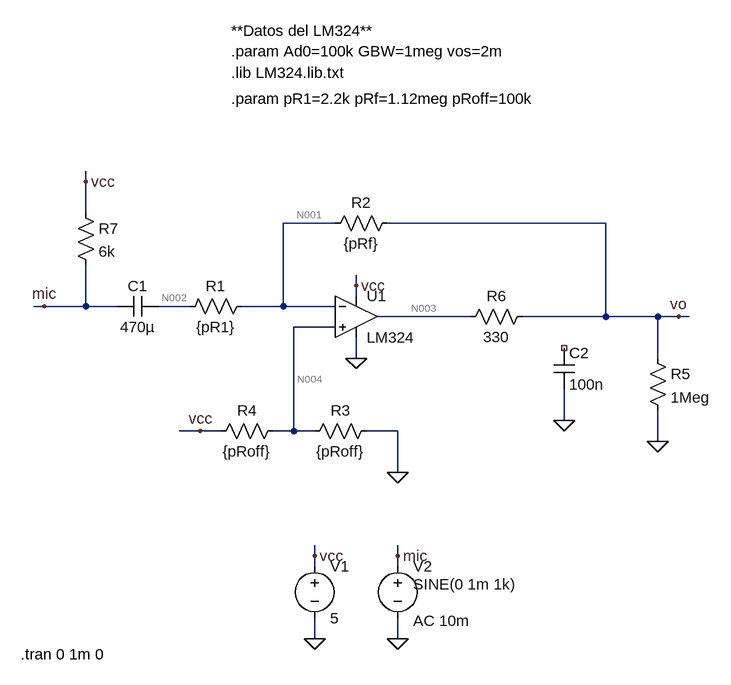
[diagram p0: schematic preamp.asc]
preamp.asc, the LTspice schematic file:
Version 4
SHEET 1 1848 744
WIRE -176 0 -176 -16
WIRE -176 48 -176 0
WIRE 208 64 128 64
WIRE 624 64 288 64
WIRE 240 160 240 144
WIRE 240 176 240 160
WIRE -240 192 -256 192
WIRE -176 192 -176 128
WIRE -176 192 -240 192
WIRE -128 192 -176 192
WIRE -16 192 -64 192
WIRE 128 192 128 64
WIRE 128 192 64 192
WIRE 208 192 128 192
WIRE 416 208 272 208
WIRE 624 208 624 64
WIRE 624 208 496 208
WIRE 704 208 624 208
WIRE 736 208 704 208
WIRE 752 208 736 208
WIRE 208 224 144 224
WIRE 240 272 240 240
WIRE 704 272 704 208
WIRE 560 368 560 320
WIRE 0 384 -32 384
WIRE 32 384 0 384
WIRE 144 384 144 224
WIRE 144 384 112 384
WIRE 176 384 144 384
WIRE 304 384 256 384
WIRE 704 400 704 352
WIRE 304 448 304 384
WIRE 176 576 176 560
WIRE 304 576 304 560
WIRE 176 592 176 576
WIRE 304 592 304 576
WIRE 176 704 176 672
WIRE 304 704 304 672
FLAG 176 704 0
FLAG 176 576 vcc
FLAG 240 160 vcc
FLAG 304 704 0
FLAG 304 576 mic
FLAG 304 448 0
FLAG 0 384 vcc
FLAG 704 400 0
FLAG -240 192 mic
FLAG 736 208 vo
FLAG 240 272 0
FLAG 560 368 0
FLAG -176 0 vcc
SYMBOL voltage 176 576 R0
WINDOW 123 0 0 Left 0
WINDOW 39 0 0 Left 0
SYMATTR InstName V1
SYMATTR Value 5
SYMBOL voltage 304 576 R0
WINDOW 3 24 44 Left 2
WINDOW 123 24 100 Left 2
WINDOW 39 24 44 Left 2
SYMATTR Value SINE(0 1m 1k)
SYMATTR Value2 AC 10m
SYMATTR InstName V2
SYMBOL res 80 176 R90
WINDOW 0 0 56 VBottom 2
WINDOW 3 32 56 VTop 2
SYMATTR InstName R1
SYMATTR Value {pR1}
SYMBOL res 304 48 R90
WINDOW 0 0 56 VBottom 2
WINDOW 3 32 56 VTop 2
SYMATTR InstName R2
SYMATTR Value {pRf}
SYMBOL res 272 368 R90
WINDOW 0 0 56 VBottom 2
WINDOW 3 32 56 VTop 2
SYMATTR InstName R3
SYMATTR Value {pRoff}
SYMBOL res 128 368 R90
WINDOW 0 0 56 VBottom 2
WINDOW 3 32 56 VTop 2
SYMATTR InstName R4
SYMATTR Value {pRoff}
SYMBOL res 688 256 R0
SYMATTR InstName R5
SYMATTR Value 1Meg
SYMBOL OpAmps\\opamp2 240 144 R0
SYMATTR InstName U1
SYMATTR Value LM324
SYMBOL cap -64 176 R90
WINDOW 0 0 32 VBottom 2
WINDOW 3 32 32 VTop 2
SYMATTR InstName C1
SYMATTR Value 470µ
SYMBOL res 512 192 R90
WINDOW 0 0 56 VBottom 2
WINDOW 3 32 56 VTop 2
SYMATTR InstName R6
SYMATTR Value 330
SYMBOL cap 544 256 R0
SYMATTR InstName C2
SYMATTR Value 100n
SYMBOL res -192 32 R0
SYMATTR InstName R7
SYMATTR Value 6k
TEXT 48 -128 Left 2 !.param pR1=2.2k pRf=1.12meg pRoff=100k
TEXT 48 -168 Left 2 !.lib LM324.lib.txt
TEXT 48 -232 Left 2 !**Datos del LM324**\n.param Ad0=100k GBW=1meg vos=2m
TEXT -276 728 Left 2 !.tran 0 1m 0

The netlist it stands for:
* preamp.asc
V1 vcc 0 5
V2 mic 0 SINE(0 1m 1k) AC 10m
R1 N001 N002 {pR1}
R2 vo N001 {pRf}
R3 0 N004 {pRoff}
R4 N004 vcc {pRoff}
R5 vo 0 1Meg
XU1 N004 N001 vcc 0 N003 LM324  ; pins In+ In- V+ V- OUT
C1 N002 mic 470µ
R6 vo N003 330
C2 NC_01 0 100n
R7 vcc mic 6k
.param pR1=2.2k pRf=1.12meg pRoff=100k
.lib LM324.lib.txt
**Datos del LM324**
.param Ad0=100k GBW=1meg vos=2m
.tran 0 1m 0
.backanno
.end

* Results of the author's LTspice run, read from the files saved beside the schematic
* Operating Point, zero values left out:
*   V(vcc) = 5 V
*   V(n001) = 2.501 V
*   V(n002) = 2.501 V
*   V(vo) = 2.479 V
*   V(n004) = 2.501 V
*   V(n003) = 2.479 V
*   I(R7) = 833.3 µA
*   I(R6) = -2.459 µA
*   I(R5) = 2.479 µA
*   I(R4) = -24.99 µA
*   I(R3) = -25.01 µA
*   I(R2) = -19.95 nA
*   I(V2) = 833.3 µA
*   I(V1) = -1.033 mA
*   Ix(u1:1) = -19.93 nA
*   Ix(u1:2) = -19.95 nA
*   Ix(u1:3) = 175 µA
*   Ix(u1:4) = -174.9 µA
*   Ix(u1:5) = -2.459 µA
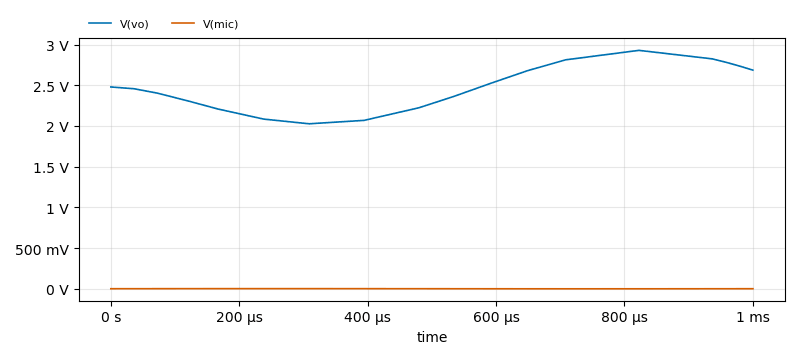
[diagram p1: Transient Analysis of preamp.asc, plotted from the saved traces]
* Transient Analysis, 1 run:
*   V(vo): min 2.026 V, max 2.928 V, average 2.46 V, rms 2.48 V, last 2.685 V
*   V(mic): min -965.9 µV, max 997 µV, average 4.37 µV, rms 700.4 µV, last 0 V